# Altium schematic sheet UWB_F3_MCU.SchDoc
size A2; Organization: Altium Limited; Address1: L3, 12a Rodborough Rd; Address2: Frenchs Forest; Address3: NSW; Address4: Australia 2086
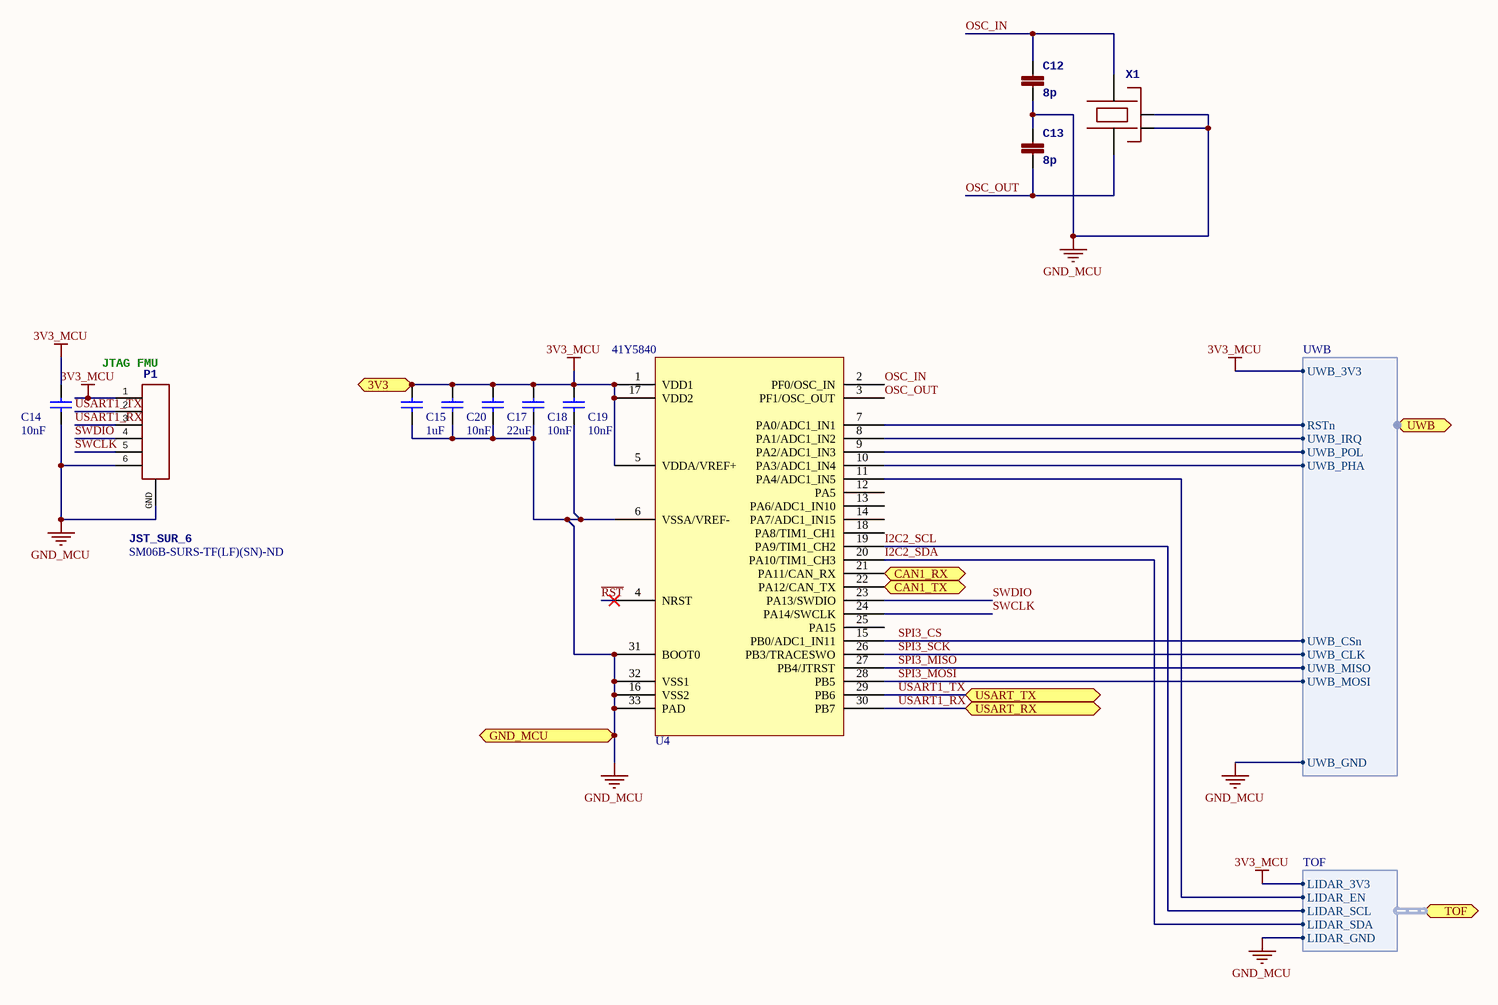
[diagram p0: UWB_F3_MCU.SchDoc]

## Parts
C12  8p  [0201-cap]
C13  8p  [0201-cap]
C14  value 10nF  [CAPC1005L]  (hidden comment: CAP CER 10000PF 50V X7R 0402)
C15  value 1uF  [CAPC1005L]  (hidden comment: Cap)
C17  value 22uF  [CAPC2012L]  (hidden comment: Cap)
C18  value 10nF  [CAPC1005L]  (hidden comment: CAP CER 10000PF 50V X7R 0402)
C19  value 10nF  [CAPC1005L]  (hidden comment: CAP CER 10000PF 50V X7R 0402)
C20  value 10nF  [CAPC1005L]  (hidden comment: CAP CER 10000PF 50V X7R 0402)
P1  JST_SUR_6  Supplier Part Number 1: SM06B-SURS-TF(LF)(SN)-ND  [JST_SUR_H6]
U4  Supplier Part Number 1: 41Y5840  [QFN50P500X500X60-32L]  (hidden comment: IC MCU M4 64KB FLASH 32UFQFPN)
X1  Crystal Oscillator in SMD 1.6 x 1.2  [OSCILLATOR-1.6x1.2]  (value not drawn)

## Ports
3V3, CAN1_RX, CAN1_TX, GND_MCU, TOF (harness TOF), USART_RX, USART_TX, UWB (harness UWB)

## Harnesses
UWB: UWB_IRQ, UWB_CLK, UWB_MISO, UWB_MOSI, UWB_CSn, UWB_POL, UWB_PHA, UWB_GND, UWB_3V3, RSTn
TOF: LIDAR_3V3, LIDAR_SDA, LIDAR_SCL, LIDAR_GND, LIDAR_EN

## Nets
3V3_MCU: C14.2 C15.1 C17.2 C18.2 C19.2 C20.2 P1.1 U4.1(VDD1) U4.5(VDDA/VREF+) U4.17(VDD2) ; port 3V3, port UWB.UWB_3V3, port TOF.LIDAR_3V3
GND_MCU: C12.2 C13.1 C14.1 C15.2 C17.1 C18.1 C19.1 C20.1 P1.6 P1.GND U4.6(VSSA/VREF-) U4.16(VSS2) U4.31(BOOT0) U4.32(VSS1) U4.33(PAD) X1.2(NC_2) X1.4(NC_4) ; port GND_MCU, port UWB.UWB_GND, port TOF.LIDAR_GND
CAN1_RX: U4.21(PA11/CAN_RX) ; port CAN1_RX
CAN1_TX: U4.22(PA12/CAN_TX) ; port CAN1_TX
I2C2_SCL: U4.19(PA9/TIM1_CH2) ; port TOF.LIDAR_SCL
I2C2_SDA: U4.20(PA10/TIM1_CH3) ; port TOF.LIDAR_SDA
OSC_IN: C12.1 U4.2(PF0/OSC_IN) X1.3
OSC_OUT: C13.2 U4.3(PF1/OSC_OUT) X1.1
~{RST}: U4.4(NRST)
SPI3_CS: U4.15(PB0/ADC1_IN11) ; port UWB.UWB_CSn
SPI3_MISO: U4.27(PB4/JTRST) ; port UWB.UWB_MISO
SPI3_MOSI: U4.28(PB5) ; port UWB.UWB_MOSI
SPI3_SCK: U4.26(PB3/TRACESWO) ; port UWB.UWB_CLK
SWCLK: P1.5 U4.24(PA14/SWCLK)
SWDIO: P1.4 U4.23(PA13/SWDIO)
USART1_RX: P1.3 U4.30(PB7) ; port USART_RX
USART1_TX: P1.2 U4.29(PB6) ; port USART_TX
NetU4_7: U4.7(PA0/ADC1_IN1) ; port UWB.RSTn
NetU4_8: U4.8(PA1/ADC1_IN2) ; port UWB.UWB_IRQ
NetU4_9: U4.9(PA2/ADC1_IN3) ; port UWB.UWB_POL
NetU4_10: U4.10(PA3/ADC1_IN4) ; port UWB.UWB_PHA
NetU4_11: U4.11(PA4/ADC1_IN5) ; port TOF.LIDAR_EN

Not connected (* = marked no-connect by the designer): U4 12(PA5) 13(PA6/ADC1_IN10) 14(PA7/ADC1_IN15) 18(PA8/TIM1_CH1) 25(PA15)

## Notes on the sheet
- (near P1) JTAG FMU
- https://github.com/OpenMotorDrive
- Title
- ProfiCNC Pty. Ltd.
- https://creativecommons.org/licenses/by-nc-sa/4.0/
- For Commercial use, please contact ProfiCNC
- ProfiCNC does NOT guaranty these drawings as fit for any purpose, you must verify this information before attempting to use it in any way.  USE AT OWN RISK
- Size:
- Date:
- File:
- A2
- Number:
- Time:
- Revision:
- Sheet
- of

## Library data of the parts
C12 C13 = CAP0402: CAP CER 8PF 50V NP0 0201; Supplier 1: Digi-Key; Supplier Part Number 1: 490-13331-1-ND
C14 C18-C20 = Cap: Supplier 1: Digi-Key; Supplier Part Number 1: 445-6893-1-ND
C15 = Cap: CAP CER 1UF 6.3V X5R 0402; Supplier 1: Digi-Key; Supplier Part Number 1: 587-3766-1-ND
C17 = Cap: Capacitor; Supplier 1: Digi-Key; Supplier Part Number 1: 587-3391-1-ND
P1 = JST_SUR_6: Connector, Header, 6Pos, .8mm IDC, R/A, SMD, Tin; Supplier 1: Digi-Key
U4 = STM32F302K8U6: 72 MHz Cortex-M4F MCU with 16 KB RAM, 64 KB flash; Supplier 1: Newark
X1 = OSCILLATOR-3.2X2.5: CRYSTAL 24MHZ 8PF SMD; Supplier 1: Digi-Key; Supplier Part Number 1: 887-1846-2-ND